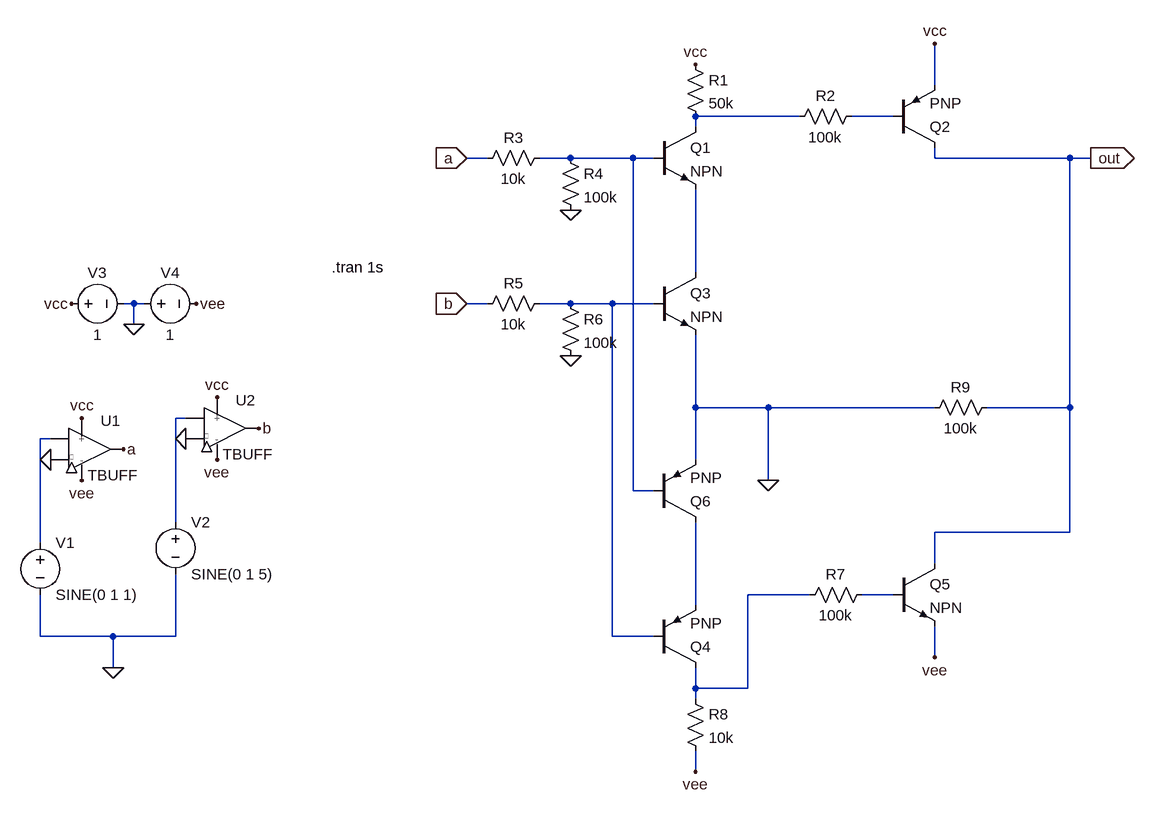
[diagram p0: schematic ensaio.asc]
ensaio.asc, the LTspice schematic file:
Version 4
SHEET 1 1876 780
WIRE 1552 -1136 1552 -1200
WIRE 1344 -1088 1184 -1088
WIRE 1488 -1088 1424 -1088
WIRE 1184 -1072 1184 -1088
WIRE 864 -1024 832 -1024
WIRE 992 -1024 944 -1024
WIRE 1088 -1024 992 -1024
WIRE 1120 -1024 1088 -1024
WIRE 1552 -1024 1552 -1040
WIRE 1760 -1024 1552 -1024
WIRE 1792 -1024 1760 -1024
WIRE 1184 -848 1184 -976
WIRE 320 -800 304 -800
WIRE 336 -800 320 -800
WIRE 864 -800 832 -800
WIRE 992 -800 944 -800
WIRE 1056 -800 992 -800
WIRE 1120 -800 1056 -800
WIRE 320 -768 320 -800
WIRE 1184 -640 1184 -752
WIRE 1296 -640 1184 -640
WIRE 1552 -640 1296 -640
WIRE 1760 -640 1760 -1024
WIRE 1760 -640 1632 -640
WIRE 400 -624 384 -624
WIRE 192 -592 176 -592
WIRE 1184 -560 1184 -640
WIRE 1296 -528 1296 -640
WIRE 1088 -512 1088 -1024
WIRE 1120 -512 1088 -512
WIRE 384 -464 384 -624
WIRE 1760 -448 1760 -640
WIRE 1760 -448 1552 -448
WIRE 176 -432 176 -592
WIRE 1552 -400 1552 -448
WIRE 1360 -352 1264 -352
WIRE 1488 -352 1440 -352
WIRE 1184 -336 1184 -464
WIRE 176 -288 176 -352
WIRE 288 -288 176 -288
WIRE 384 -288 384 -384
WIRE 384 -288 288 -288
WIRE 1056 -288 1056 -800
WIRE 1120 -288 1056 -288
WIRE 1552 -256 1552 -304
WIRE 288 -240 288 -288
WIRE 1184 -208 1184 -240
WIRE 1264 -208 1264 -352
WIRE 1264 -208 1184 -208
WIRE 1184 -192 1184 -208
WIRE 1184 -80 1184 -112
FLAG 304 -576 a
FLAG 512 -608 b
FLAG 400 -592 0
FLAG 192 -560 0
FLAG 240 -624 vcc
FLAG 448 -656 vcc
FLAG 448 -560 vee
FLAG 240 -528 vee
FLAG 288 -240 0
FLAG 416 -800 vee
FLAG 224 -800 vcc
FLAG 320 -768 0
FLAG 1792 -1024 out
IOPIN 1792 -1024 Out
FLAG 1184 -1168 vcc
FLAG 1552 -1200 vcc
FLAG 832 -1024 a
IOPIN 832 -1024 In
FLAG 992 -944 0
FLAG 832 -800 b
IOPIN 832 -800 In
FLAG 992 -720 0
FLAG 1184 -80 vee
FLAG 1552 -256 vee
FLAG 1296 -528 0
SYMBOL voltage 176 -448 R0
SYMATTR InstName V1
SYMATTR Value SINE(0 1 1)
SYMBOL voltage 384 -480 R0
SYMATTR InstName V2
SYMATTR Value SINE(0 1 5)
SYMBOL TBUFF 256 -576 R0
SYMATTR InstName U1
SYMBOL TBUFF 464 -608 R0
SYMATTR InstName U2
SYMBOL voltage 208 -800 R270
WINDOW 0 32 56 VTop 2
WINDOW 3 -32 56 VBottom 2
SYMATTR InstName V3
SYMATTR Value 1
SYMBOL voltage 320 -800 R270
WINDOW 0 32 56 VTop 2
WINDOW 3 -32 56 VBottom 2
SYMATTR InstName V4
SYMATTR Value 1
SYMBOL Res 1168 -1184 R0
SYMATTR InstName R1
SYMATTR Value 50k
SYMBOL npn 1120 -1072 R0
SYMATTR InstName Q1
SYMBOL Res 1440 -1104 R90
WINDOW 0 0 56 VBottom 2
WINDOW 3 32 56 VTop 2
SYMATTR InstName R2
SYMATTR Value 100k
SYMBOL pnp 1488 -1040 M180
SYMATTR InstName Q2
SYMBOL Res 960 -1040 R90
WINDOW 0 0 56 VBottom 2
WINDOW 3 32 56 VTop 2
SYMATTR InstName R3
SYMATTR Value 10k
SYMBOL Res 976 -1040 R0
SYMATTR InstName R4
SYMATTR Value 100k
SYMBOL Res 960 -816 R90
WINDOW 0 0 56 VBottom 2
WINDOW 3 32 56 VTop 2
SYMATTR InstName R5
SYMATTR Value 10k
SYMBOL Res 976 -816 R0
SYMATTR InstName R6
SYMATTR Value 100k
SYMBOL npn 1120 -848 R0
SYMATTR InstName Q3
SYMBOL Res 1456 -368 R90
WINDOW 0 0 56 VBottom 2
WINDOW 3 32 56 VTop 2
SYMATTR InstName R7
SYMATTR Value 100k
SYMBOL Res 1168 -208 R0
SYMATTR InstName R8
SYMATTR Value 10k
SYMBOL pnp 1120 -240 M180
SYMATTR InstName Q4
SYMBOL npn 1488 -400 R0
SYMATTR InstName Q5
SYMBOL pnp 1120 -464 M180
SYMATTR InstName Q6
SYMBOL Res 1648 -656 R90
WINDOW 0 0 56 VBottom 2
WINDOW 3 32 56 VTop 2
SYMATTR InstName R9
SYMATTR Value 100k
TEXT 624 -856 Left 2 !.tran 1s

The netlist it stands for:
* ensaio.asc
V1 N007 0 SINE(0 1 1)
V2 N006 0 SINE(0 1 5)
XU1 N007 vcc vee a 0 TBUFF  ; pins in vcc vee out gnd
XU2 N006 vcc vee b 0 TBUFF  ; pins in vcc vee out gnd
V3 vcc 0 1
V4 0 vee 1
R1 vcc N001 50k
Q1 N001 N003 N004 0 NPN
R2 N002 N001 100k
Q2 out N002 vcc 0 PNP
R3 N003 a 10k
R4 N003 0 100k
R5 N005 b 10k
R6 N005 0 100k
Q3 N004 N005 0 0 NPN
R7 N009 N008 100k
R8 N008 vee 10k
Q4 N008 N005 N010 0 PNP
Q5 out N009 vee 0 NPN
Q6 N010 N003 0 0 PNP
R9 out 0 100k
.model NPN NPN
.model PNP PNP
.lib standard.bjt
.tran 1s
.lib /Users/manoelribeiroalmeida/dev/trit/LTspice/TBUFF.sub
.backanno
.end